# Altium project rockets_test_bench_acquisition.PrjPcb
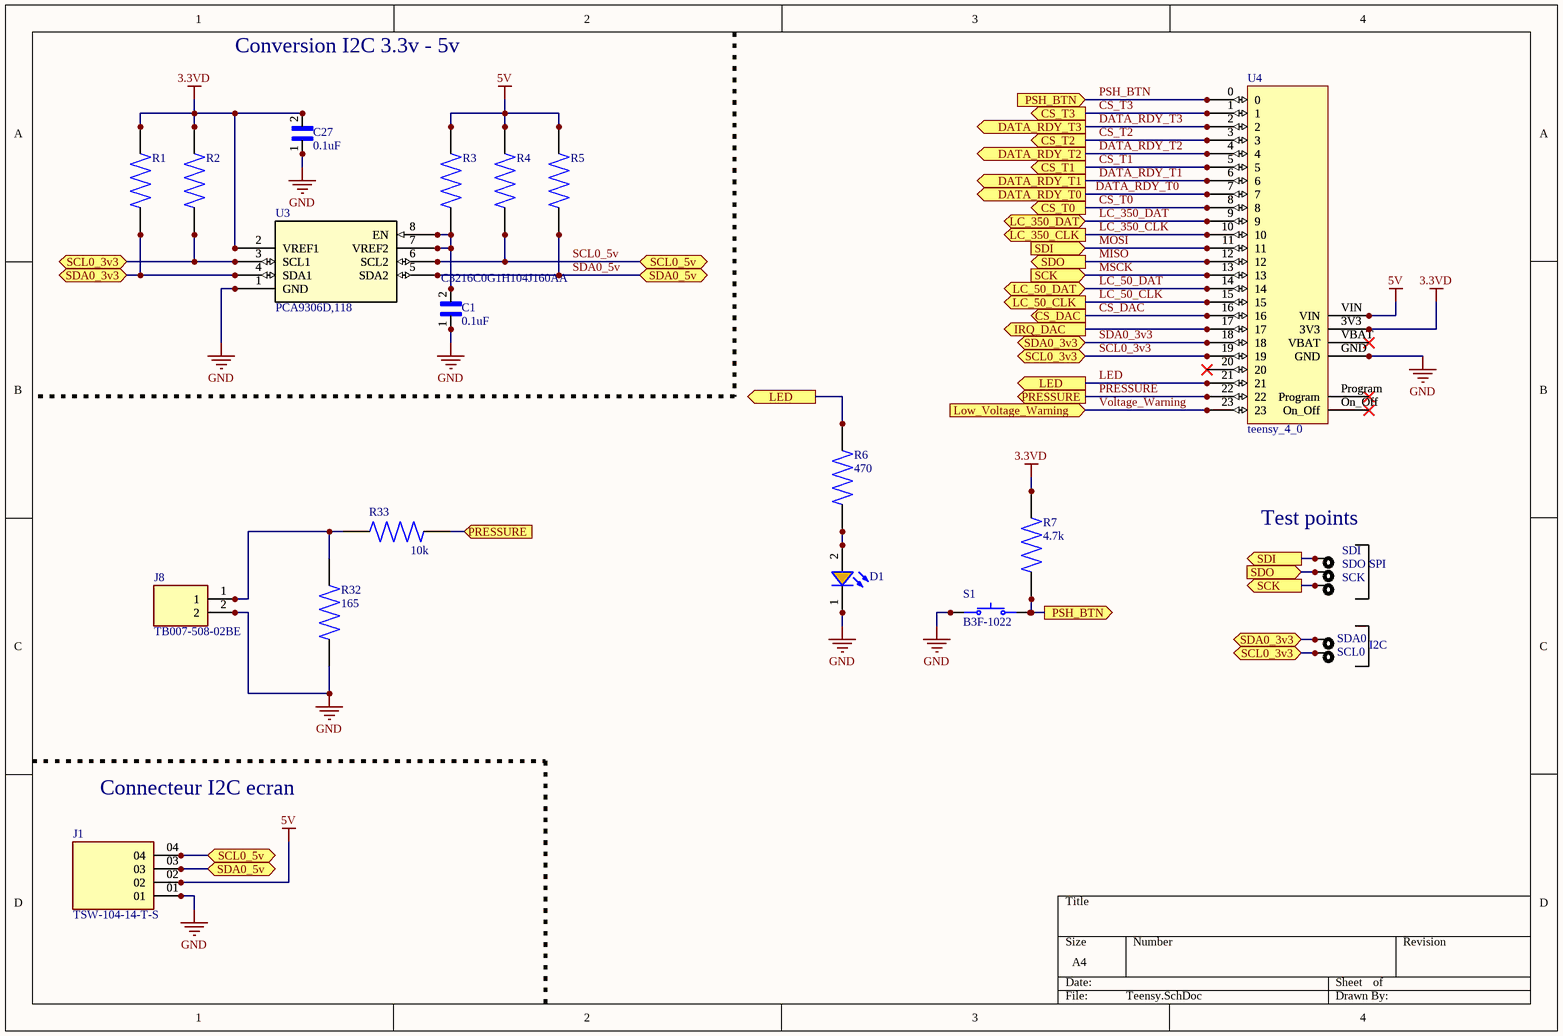
[diagram p0: Teensy.SchDoc]
5 sheets, 106 parts. Net scope: flat (ports and power ports of the same name join across sheets).
Board file: PCB_rockets_test_bench_acquisition.PcbDoc
Sheets:
  Teensy.SchDoc
  Thermocouples.SchDoc
  Loadcells.SchDoc
  DAC.SchDoc
  Alim.SchDoc

## Sheet Teensy.SchDoc
size A4

### Parts
C1  C3216C0G1H104J160AA  value 0.1uF  [C3216C0G1H104J160AA]
C27  value 0.1uF  [C3216C0G1H104J160AA]  (hidden comment: C3216C0G1H104J160AA)
D1  150120YS75000  [150120YS75000]  (value not drawn)
J1  TSW-104-14-T-S  [TSW-104-14-T-S]
J8  TB007-508-02BE  [CUI_TB007-508-02BE]
R1  ESR10EZPJ222  [RESC2012X65N]  (value not drawn)
R2  ESR10EZPJ222  [RESC2012X65N]  (value not drawn)
R3  ERJ-6GEYJ204V  [RESC2012X70N]  (value not drawn)
R4  ESR10EZPJ222  [RESC2012X65N]  (value not drawn)
R5  ESR10EZPJ222  [RESC2012X65N]  (value not drawn)
R6  value 470  [RMCF1206JT470R]  (hidden comment: RMCF1206JT470R)
R7  value 4.7k  [CRGH0805F4K7]  (hidden comment: CRGH0805F4K7)
R32  value 165  [RC1206FR-07165RL]  (hidden comment: RC1206FR-07165RL)
R33  value 10k  [ERJ-P06J103V]  (hidden comment: ERJ-P06J103V)
S1  B3F-1022  [B3F-1022]
SCK  RCS-0C  [RCS-0C]  (value not drawn)
SCL0  RCS-0C  [RCS-0C]  (value not drawn)
SDA0  RCS-0C  [RCS-0C]  (value not drawn)
SDI  RCS-0C  [RCS-0C]  (value not drawn)
SDO  RCS-0C  [RCS-0C]  (value not drawn)
U3  PCA9306D,118  [SO8_SOT96-1_NXP]
U4  teensy_4_0  [teensy_4_0]

### Ports
CS_DAC (out), CS_T0 (out), CS_T1 (out), CS_T2 (out), CS_T3 (out), DATA_RDY_T0 (out), DATA_RDY_T1 (out), DATA_RDY_T2 (out), DATA_RDY_T3 (out), IRQ_DAC (out), LC_50_CLK (out), LC_50_DAT (bidir), LC_350_CLK (out), LC_350_DAT (bidir), LED (out), Low_Voltage_Warning (in), PRESSURE (in), PRESSURE (out), PSH_BTN (in), PSH_BTN (out), SCK (in), SCK (out), SCL0_3v3 (bidir), SCL0_5v (bidir), SDA0_3v3 (bidir), SDA0_5v (bidir), SDI (in), SDI (out), SDO (in), SDO (out)

### Nets
3.3VD: C27.2 R1.2 R2.2 R7.2 U3.2(VREF1) U4.3V3
5V: J1.02 R3.2 R4.2 R5.2 U4.VIN
GND: C1.1 C27.1 D1.1(K) J1.01 J8.2 R32.1 S1.1(COM) U3.1(GND) U4.GND
CS_DAC: U4.16 ; port CS_DAC
CS_T0: U4.8 ; port CS_T0
CS_T1: U4.5 ; port CS_T1
CS_T2: U4.3 ; port CS_T2
CS_T3: U4.1 ; port CS_T3
DATA_RDY_T0: U4.7 ; port DATA_RDY_T0
DATA_RDY_T1: U4.6 ; port DATA_RDY_T1
DATA_RDY_T2: U4.4 ; port DATA_RDY_T2
DATA_RDY_T3: U4.2 ; port DATA_RDY_T3
LC_50_CLK: U4.15 ; port LC_50_CLK
LC_50_DAT: U4.14 ; port LC_50_DAT
LC_350_CLK: U4.10 ; port LC_350_CLK
LC_350_DAT: U4.9 ; port LC_350_DAT
LED: R6.2 U4.21 ; port LED
MISO: SDO.1 U4.12 ; port SDO
MOSI: SDI.1 U4.11 ; port SDI
MSCK: SCK.1 U4.13 ; port SCK
PRESSURE: R33.2 U4.22 ; port PRESSURE
PSH_BTN: R7.1 S1.3(NO) U4.0 ; port PSH_BTN
SCL0_3v3: R2.1 SCL0.1 U3.3(SCL1) U4.19 ; port SCL0_3v3
SCL0_5v: J1.04 R4.1 U3.6(SCL2) ; port SCL0_5v
SDA0_3v3: R1.1 SDA0.1 U3.4(SDA1) U4.18 ; port SDA0_3v3
SDA0_5v: J1.03 R5.1 U3.5(SDA2) ; port SDA0_5v
Voltage_Warning: U4.23 ; port Low_Voltage_Warning
NetC1_2: C1.2 R3.1 U3.7(VREF2) U3.8(EN)
NetD1_2: D1.2(A) R6.1
NetJ8_1: J8.1 R32.2 R33.1
NetR16_1: U4.17 ; port IRQ_DAC

Not connected (* = marked no-connect by the designer): U4 20* On_Off* Program* VBAT*

### Notes on the sheet
- Conversion I2C 3.3v - 5v
- Test points
- SPI
- I2C
- Connecteur I2C ecran

### Library data of the parts
D1 = 150120YS75000: Yellow 590nm LED Indication - Discrete 2V 1206 (3216 Metric)
J8 = TB007-508-02BE: 2~24 Poles, Screw Type, Horizontal, 5.08 Pitch, 24~12 _AWG_, Terminal Block Connector; MF: CUI Devices; SnapEDA_Link: https://www.snapeda.com/parts/TB007-508-02BE/CUI%20Devices/view-part/3591212/?ref=snap; Value: *; Availability: Unavailable; MP: TB007-508-02BE; Price: None; Package: None
R1 R2 R4 R5 = ESR10EZPJ222: 2.2 kOhms Â±5% 0.4W, 2/5W Chip Resistor 0805 (2012 Metric) Automotive AEC-Q200, Pulse Withstanding Thick Film; MF: Rohm; MP: ESR10EZPJ222; Value: *; Purchase-URL: https://pricing.snapeda.com/search/part/ESR10EZPJ222/?ref=eda; Package: 2012 Rohm Semiconductor; Check_prices: https://www.snapeda.com/parts/ESR10EZPJ222/Rohm/view-part/977759/?ref=eda; Digi-Key_Part_Number: RHM2.2KKCT-ND; SnapEDA_Link: https://www.snapeda.com/parts/ESR10EZPJ222/Rohm/view-part/977759/?ref=snap
R3 = ERJ-6GEYJ204V: Resistor;Thick Film;Res 200 Kilohms;Pwr-Rtg 0.125 W;Tol 5%;SMT;0805;Tape & Reel; Package: None; Price: None; Value: *; MP: ERJ-6GEYJ204V; Availability: Unavailable
R6 = RMCF1206JT470R: RES 470 OHM 5% 1/4W 1206
R7 = CRGH0805F4K7: CRGH0805 1% 4K7 0.33W; Tolerance: ±1%
R32 = RC1206FR-07165RL: 165 Ohms ±1% 0.25W, 1/4W Chip Resistor 1206 (3216 Metric) Moisture Resistant Thick Film; Tolerance: ±1%
R33 = ERJ-P06J103V: RES SMD 10K OHM 5% 1/2W 0805; Tolerance: ±5%
S1 = B3F-1022: SWITCH TACTILE SPST-NO 0.05A 24V; pin to pad: 1>1+2 3>3+4
SCK SCL0 SDA0 SDI SDO = RCS-0C: PC TEST POINT NATURAL
U3 = PCA9306D,118: No Description Available; Vendor: NXP; Built_By: EMA_Cory; SourceLibrary: Add_to_database_2021-01-28; Datasheet: https://www.nxp.com/docs/en/data-sheet/PCA9306.pdf; Manufacturer_Part_Number: PCA9306D,118; Copyright: Copyright (C) 2018 Accelerated Designs. All rights reserved; RefDes: RefDes; Type: DEV

## Sheet Thermocouples.SchDoc
size A4
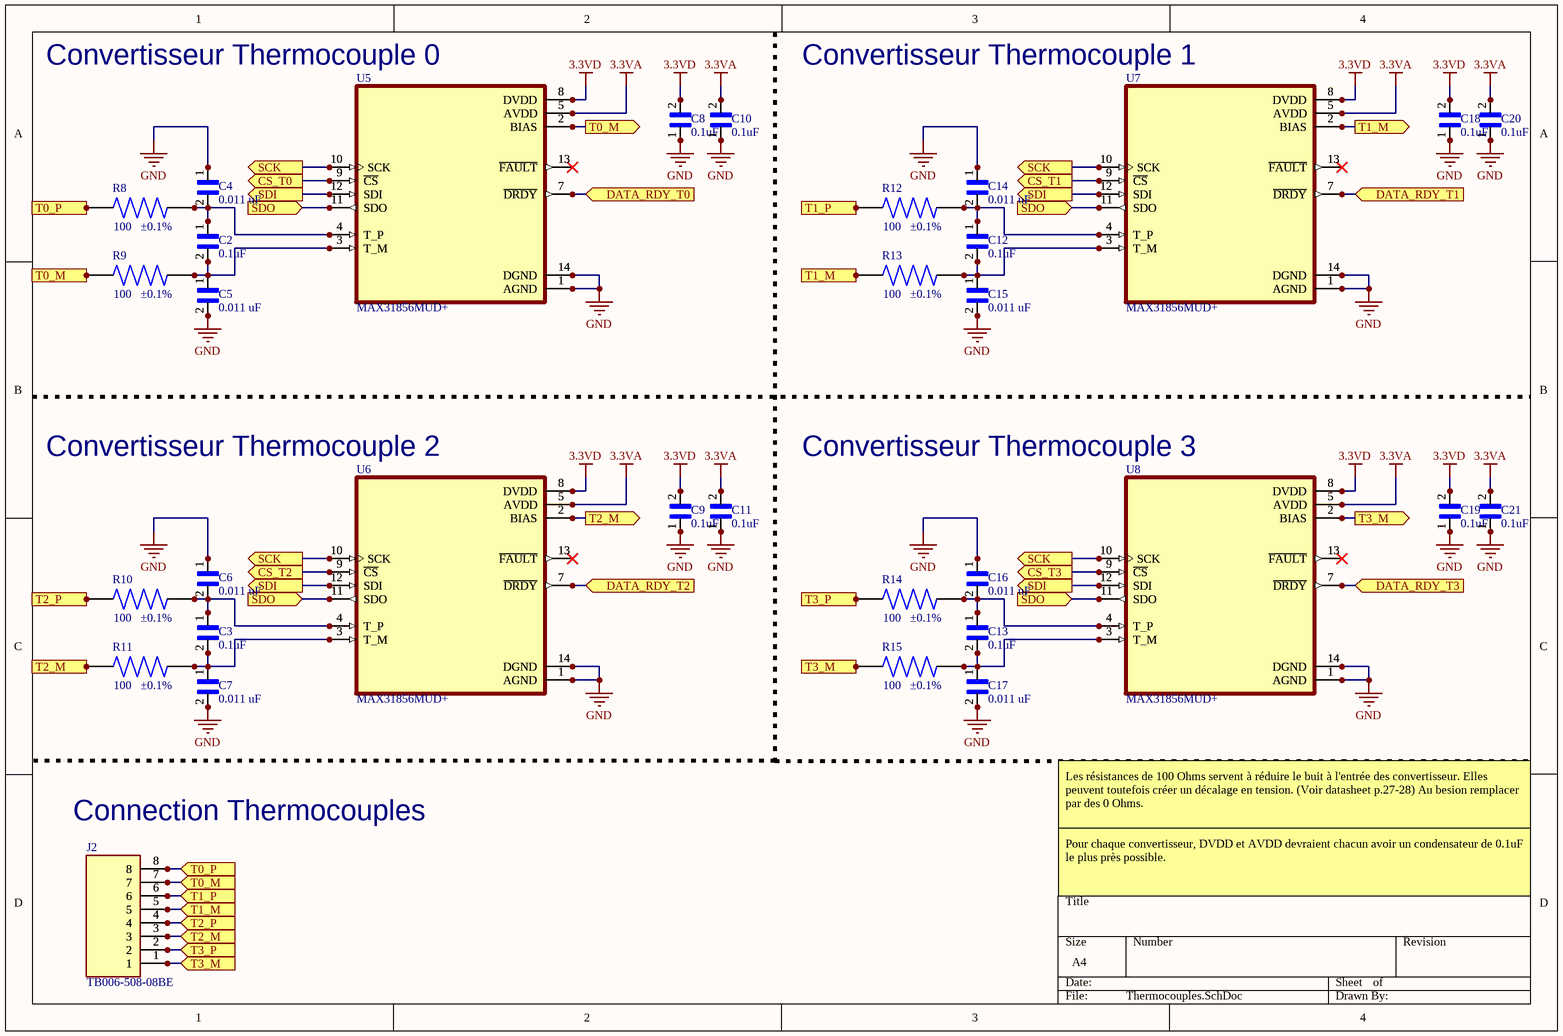
[diagram p1: Thermocouples.SchDoc]

### Parts
C2  value 0.1uF  [C3216C0G1H104J160AA]  (hidden comment: C3216C0G1H104J160AA)
C3  value 0.1uF  [C3216C0G1H104J160AA]  (hidden comment: C3216C0G1H104J160AA)
C4  value 0.011 uF  [GRM3195C1H113JA01D]  (hidden comment: GRM3195C1H113JA01D)
C5  value 0.011 uF  [GRM3195C1H113JA01D]  (hidden comment: GRM3195C1H113JA01D)
C6  value 0.011 uF  [GRM3195C1H113JA01D]  (hidden comment: GRM3195C1H113JA01D)
C7  value 0.011 uF  [GRM3195C1H113JA01D]  (hidden comment: GRM3195C1H113JA01D)
C8  value 0.1uF  [C3216C0G1H104J160AA]  (hidden comment: C3216C0G1H104J160AA)
C9  value 0.1uF  [C3216C0G1H104J160AA]  (hidden comment: C3216C0G1H104J160AA)
C10  value 0.1uF  [C3216C0G1H104J160AA]  (hidden comment: C3216C0G1H104J160AA)
C11  value 0.1uF  [C3216C0G1H104J160AA]  (hidden comment: C3216C0G1H104J160AA)
C12  value 0.1uF  [C3216C0G1H104J160AA]  (hidden comment: C3216C0G1H104J160AA)
C13  value 0.1uF  [C3216C0G1H104J160AA]  (hidden comment: C3216C0G1H104J160AA)
C14  value 0.011 uF  [GRM3195C1H113JA01D]  (hidden comment: GRM3195C1H113JA01D)
C15  value 0.011 uF  [GRM3195C1H113JA01D]  (hidden comment: GRM3195C1H113JA01D)
C16  value 0.011 uF  [GRM3195C1H113JA01D]  (hidden comment: GRM3195C1H113JA01D)
C17  value 0.011 uF  [GRM3195C1H113JA01D]  (hidden comment: GRM3195C1H113JA01D)
C18  value 0.1uF  [C3216C0G1H104J160AA]  (hidden comment: C3216C0G1H104J160AA)
C19  value 0.1uF  [C3216C0G1H104J160AA]  (hidden comment: C3216C0G1H104J160AA)
C20  value 0.1uF  [C3216C0G1H104J160AA]  (hidden comment: C3216C0G1H104J160AA)
C21  value 0.1uF  [C3216C0G1H104J160AA]  (hidden comment: C3216C0G1H104J160AA)
J2  TB006-508-08BE  [TB006-508-08BE]
R8  value 100  Tolerance: ±0.1%  [RNCS1206BKE100R]  (hidden comment: RNCS1206BKE100R)
R9  value 100  Tolerance: ±0.1%  [RNCS1206BKE100R]  (hidden comment: RNCS1206BKE100R)
R10  value 100  Tolerance: ±0.1%  [RNCS1206BKE100R]  (hidden comment: RNCS1206BKE100R)
R11  value 100  Tolerance: ±0.1%  [RNCS1206BKE100R]  (hidden comment: RNCS1206BKE100R)
R12  value 100  Tolerance: ±0.1%  [RNCS1206BKE100R]  (hidden comment: RNCS1206BKE100R)
R13  value 100  Tolerance: ±0.1%  [RNCS1206BKE100R]  (hidden comment: RNCS1206BKE100R)
R14  value 100  Tolerance: ±0.1%  [RNCS1206BKE100R]  (hidden comment: RNCS1206BKE100R)
R15  value 100  Tolerance: ±0.1%  [RNCS1206BKE100R]  (hidden comment: RNCS1206BKE100R)
U5  MAX31856MUD+  [PCBComponent_1]
U6  MAX31856MUD+  [PCBComponent_1]
U7  MAX31856MUD+  [PCBComponent_1]
U8  MAX31856MUD+  [PCBComponent_1]

### Ports
CS_T0 (out), CS_T1 (out), CS_T2 (out), CS_T3 (out), DATA_RDY_T0 (in), DATA_RDY_T1 (in), DATA_RDY_T2 (in), DATA_RDY_T3 (in), SCK (out), SDI (out), SDO (in), T0_M (in), T0_M (out), T0_P (in), T0_P (out), T1_M (in), T1_M (out), T1_P (in), T1_P (out), T2_M (in), T2_M (out), T2_P (in), T2_P (out), T3_M (in), T3_M (out), T3_P (in), T3_P (out)

### Nets
3.3VA: C10.2 C11.2 C20.2 C21.2 U5.5(AVDD) U6.5(AVDD) U7.5(AVDD) U8.5(AVDD)
3.3VD: C8.2 C9.2 C18.2 C19.2 U5.8(DVDD) U6.8(DVDD) U7.8(DVDD) U8.8(DVDD)
GND: C4.1 C5.2 C6.1 C7.2 C8.1 C9.1 C10.1 C11.1 C14.1 C15.2 C16.1 C17.2 C18.1 C19.1 C20.1 C21.1 U5.1(AGND) U5.14(DGND) U6.1(AGND) U6.14(DGND) U7.1(AGND) U7.14(DGND) U8.1(AGND) U8.14(DGND)
CS_T0: U5.9(~{CS}) ; port CS_T0
CS_T1: U7.9(~{CS}) ; port CS_T1
CS_T2: U6.9(~{CS}) ; port CS_T2
CS_T3: U8.9(~{CS}) ; port CS_T3
DATA_RDY_T0: U5.7(~{DRDY}) ; port DATA_RDY_T0
DATA_RDY_T1: U7.7(~{DRDY}) ; port DATA_RDY_T1
DATA_RDY_T2: U6.7(~{DRDY}) ; port DATA_RDY_T2
DATA_RDY_T3: U8.7(~{DRDY}) ; port DATA_RDY_T3
MISO: U5.11(SDO) U6.11(SDO) U7.11(SDO) U8.11(SDO) ; port SDO
MOSI: U5.12(SDI) U6.12(SDI) U7.12(SDI) U8.12(SDI) ; port SDI
MSCK: U5.10(SCK) U6.10(SCK) U7.10(SCK) U8.10(SCK) ; port SCK
NetC2_1: C2.1 C4.2 R8.2 U5.4(T_P)
NetC2_2: C2.2 C5.1 R9.2 U5.3(T_M)
NetC3_1: C3.1 C6.2 R10.2 U6.4(T_P)
NetC3_2: C3.2 C7.1 R11.2 U6.3(T_M)
NetC12_1: C12.1 C14.2 R12.2 U7.4(T_P)
NetC12_2: C12.2 C15.1 R13.2 U7.3(T_M)
NetC13_1: C13.1 C16.2 R14.2 U8.4(T_P)
NetC13_2: C13.2 C17.1 R15.2 U8.3(T_M)
NetJ2_1: J2.1 R15.1 U8.2(BIAS) ; port T3_M
NetJ2_2: J2.2 R14.1 ; port T3_P
NetJ2_3: J2.3 R11.1 U6.2(BIAS) ; port T2_M
NetJ2_4: J2.4 R10.1 ; port T2_P
NetJ2_5: J2.5 R13.1 U7.2(BIAS) ; port T1_M
NetJ2_6: J2.6 R12.1 ; port T1_P
NetJ2_7: J2.7 R9.1 U5.2(BIAS) ; port T0_M
NetJ2_8: J2.8 R8.1 ; port T0_P

Not connected (* = marked no-connect by the designer): U5 13(~{FAULT})*; U6 13(~{FAULT})*; U7 13(~{FAULT})*; U8 13(~{FAULT})*

### Notes on the sheet
- (near U5) Convertisseur Thermocouple 0
- (near U7) Convertisseur Thermocouple 1
- (near U6) Convertisseur Thermocouple 2
- (near U8) Convertisseur Thermocouple 3
- (near J2) Connection Thermocouples
- Les résistances de 100 Ohms servent à réduire le buit à l'entrée des convertisseur. Elles peuvent toutefois créer un décalage en tension. (Voir datasheet p.27-28) Au besion remplacer par des 0 Ohms.
- Pour chaque convertisseur, DVDD et AVDD devraient chacun avoir un condensateur de 0.1uF le plus près possible.

### Library data of the parts
R8-R15 = RNCS1206BKE100R: Res Thin Film 1206 100 Ohm 0.1% 0.125W(1/8W); Supplier 1: Digi-Key; Supplier Part Number 1: RNCS1206BKE100RCT-ND

## Sheet Loadcells.SchDoc
size A4
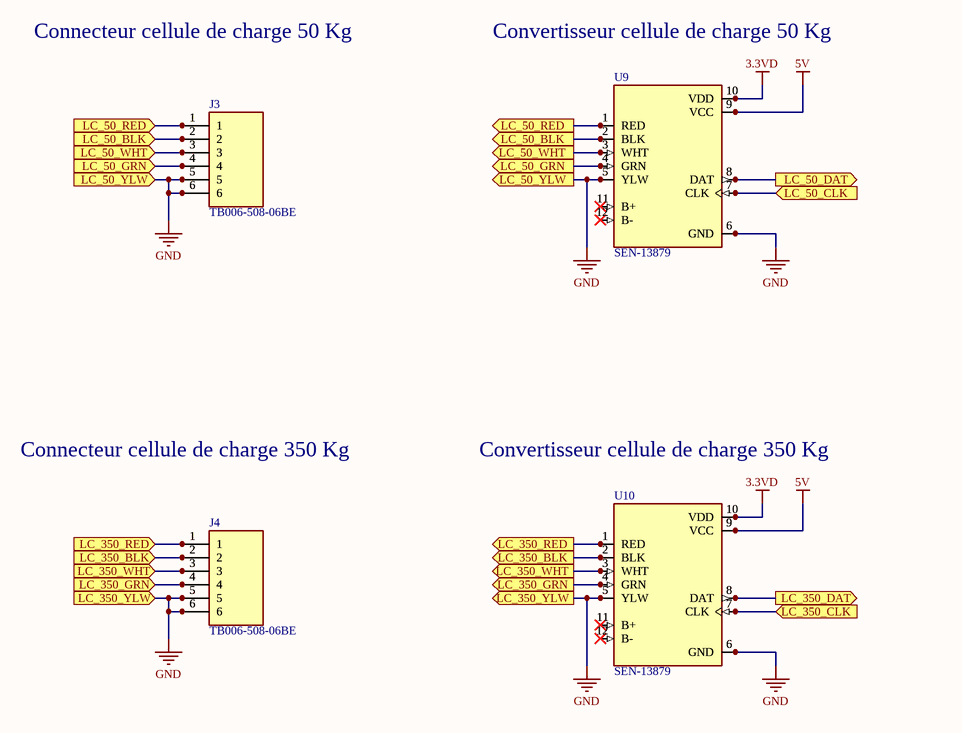
[diagram p2: Loadcells.SchDoc]

### Parts
J3  TB006-508-06BE  [TB006-508-06BE]
J4  TB006-508-06BE  [TB006-508-06BE]
U9  SEN-13879  [SPARKFUN_SEN-13879]
U10  SEN-13879  [SPARKFUN_SEN-13879]

### Ports
LC_50_BLK (in), LC_50_BLK (out), LC_50_CLK (in), LC_50_DAT (out), LC_50_GRN (in), LC_50_GRN (out), LC_50_RED (in), LC_50_RED (out), LC_50_WHT (in), LC_50_WHT (out), LC_50_YLW (in), LC_50_YLW (out), LC_350_BLK (in), LC_350_BLK (out), LC_350_CLK (in), LC_350_DAT (out), LC_350_GRN (in), LC_350_GRN (out), LC_350_RED (in), LC_350_RED (out), LC_350_WHT (in), LC_350_WHT (out), LC_350_YLW (in), LC_350_YLW (out)

### Nets
3.3VD: U9.10(VDD) U10.10(VDD)
5V: U9.9(VCC) U10.9(VCC)
GND: J3.5 J3.6 J4.5 J4.6 U9.5(YLW) U9.6(GND) U10.5(YLW) U10.6(GND) ; port LC_50_YLW, port LC_350_YLW
LC_50_CLK: U9.7(CLK) ; port LC_50_CLK
LC_50_DAT: U9.8(DAT) ; port LC_50_DAT
LC_350_CLK: U10.7(CLK) ; port LC_350_CLK
LC_350_DAT: U10.8(DAT) ; port LC_350_DAT
NetJ3_1: J3.1 U9.1(RED) ; port LC_50_RED
NetJ3_2: J3.2 U9.2(BLK) ; port LC_50_BLK
NetJ3_3: J3.3 U9.3(WHT) ; port LC_50_WHT
NetJ3_4: J3.4 U9.4(GRN) ; port LC_50_GRN
NetJ4_1: J4.1 U10.1(RED) ; port LC_350_RED
NetJ4_2: J4.2 U10.2(BLK) ; port LC_350_BLK
NetJ4_3: J4.3 U10.3(WHT) ; port LC_350_WHT
NetJ4_4: J4.4 U10.4(GRN) ; port LC_350_GRN

Not connected (* = marked no-connect by the designer): U9 11(B+)* 12(B-)*; U10 11(B+)* 12(B-)*

### Notes on the sheet
- Connecteur cellule de charge 50 Kg
- Convertisseur cellule de charge 50 Kg
- Connecteur cellule de charge 350 Kg
- Convertisseur cellule de charge 350 Kg

### Library data of the parts
J3 J4 = TB006-508-06BE: TERMINAL BLOCK, SCREW TYPE, 5.08
U9 U10 = SEN-13879: External Input Sensor Amplifier; MF: SparkFun; MP: SEN-13879; Package: None; Price: None; Availability: Unavailable; Value: *; SnapEDA_Link: https://www.snapeda.com/parts/SEN-13879/SparkFun%20Electronics/view-part/563337/?ref=snap

## Sheet DAC.SchDoc
size A4
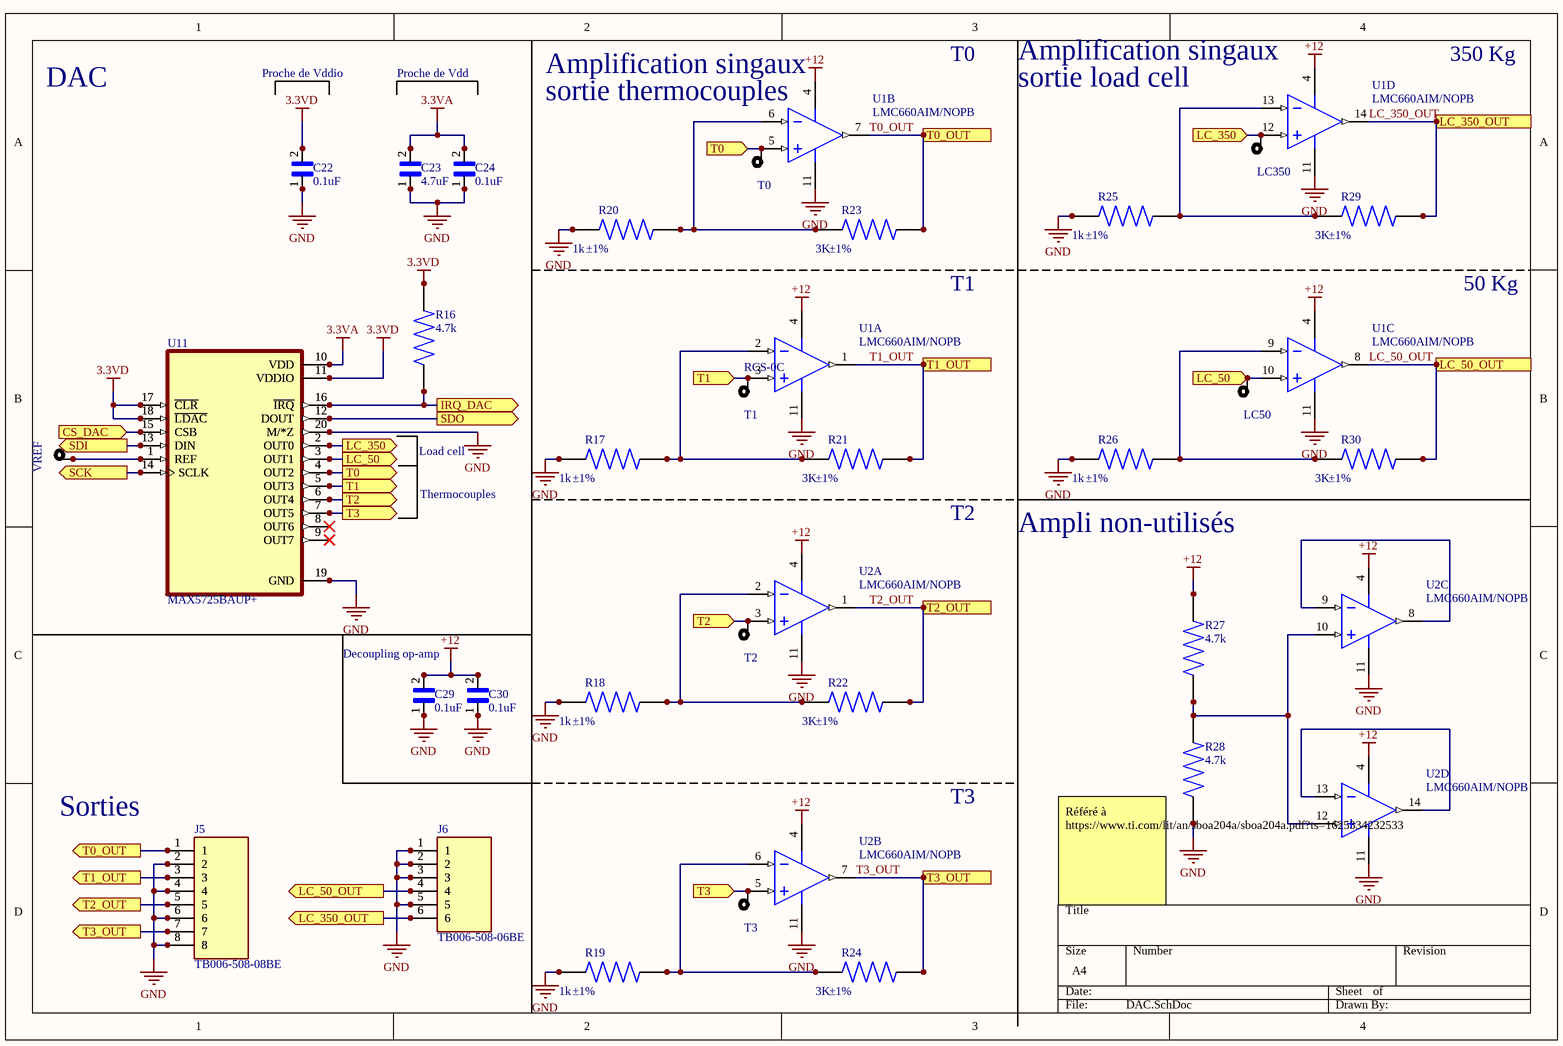
[diagram p3: DAC.SchDoc]

### Parts
C22  value 0.1uF  [C3216C0G1H104J160AA]  (hidden comment: C3216C0G1H104J160AA)
C23  value 4.7uF  [EMK212BB7475MD-T]  (hidden comment: EMK212BB7475MD-T)
C24  value 0.1uF  [C3216C0G1H104J160AA]  (hidden comment: C3216C0G1H104J160AA)
C29  value 0.1uF  [C3216C0G1H104J160AA]  (hidden comment: C3216C0G1H104J160AA)
C30  value 0.1uF  [C3216C0G1H104J160AA]  (hidden comment: C3216C0G1H104J160AA)
J5  TB006-508-08BE  [TB006-508-08BE]
J6  TB006-508-06BE  [TB006-508-06BE]
LC50  RCS-0C  [RCS-0C]  (value not drawn)
LC350  RCS-0C  [RCS-0C]  (value not drawn)
R16  value 4.7k  [CRGH0805F4K7]  (hidden comment: CRGH0805F4K7)
R17  value 1k  Tolerance: ±1%  [CR0805-FX-1001ELF]  (hidden comment: CR0805-FX-1001ELF)
R18  value 1k  Tolerance: ±1%  [CR0805-FX-1001ELF]  (hidden comment: CR0805-FX-1001ELF)
R19  value 1k  Tolerance: ±1%  [CR0805-FX-1001ELF]  (hidden comment: CR0805-FX-1001ELF)
R20  value 1k  Tolerance: ±1%  [CR0805-FX-1001ELF]  (hidden comment: CR0805-FX-1001ELF)
R21  value 3K  Tolerance: ±1%  [CRG0805F3K0]  (hidden comment: CRG0805F3K0)
R22  value 3K  Tolerance: ±1%  [CRG0805F3K0]  (hidden comment: CRG0805F3K0)
R23  value 3K  Tolerance: ±1%  [CRG0805F3K0]  (hidden comment: CRG0805F3K0)
R24  value 3K  Tolerance: ±1%  [CRG0805F3K0]  (hidden comment: CRG0805F3K0)
R25  value 1k  Tolerance: ±1%  [CR0805-FX-1001ELF]  (hidden comment: CR0805-FX-1001ELF)
R26  value 1k  Tolerance: ±1%  [CR0805-FX-1001ELF]  (hidden comment: CR0805-FX-1001ELF)
R27  value 4.7k  [CRGH0805F4K7]  (hidden comment: CRGH0805F4K7)
R28  value 4.7k  [CRGH0805F4K7]  (hidden comment: CRGH0805F4K7)
R29  value 3K  Tolerance: ±1%  [CRG0805F3K0]  (hidden comment: CRG0805F3K0)
R30  value 3K  Tolerance: ±1%  [CRG0805F3K0]  (hidden comment: CRG0805F3K0)
T0  RCS-0C  [RCS-0C]  (value not drawn)
T1  RCS-0C  [RCS-0C]
T2  RCS-0C  [RCS-0C]  (value not drawn)
T3  RCS-0C  [RCS-0C]  (value not drawn)
U1  LMC660AIM/NOPB  [D0014A_N]  (parts A,B,C,D of 4)
U2  LMC660AIM/NOPB  [D0014A_N]  (parts A,B,C,D of 4)
U11  MAX5725BAUP+  [MAX5725BAUP+]
VREF  RCS-0C  [RCS-0C]  (value not drawn)

### Ports
CS_DAC (in), IRQ_DAC (out), LC_50 (in), LC_50 (out), LC_50_OUT (in), LC_50_OUT (out), LC_350 (in), LC_350 (out), LC_350_OUT (in), LC_350_OUT (out), SCK (out), SDI (out), SDO (out), T0 (in), T0 (out), T0_OUT (in), T0_OUT (out), T1 (in), T1 (out), T1_OUT (in), T1_OUT (out), T2 (in), T2 (out), T2_OUT (in), T2_OUT (out), T3 (in), T3 (out), T3_OUT (in), T3_OUT (out)

### Nets
3.3VA: C23.2 C24.2 U11.10(VDD)
3.3VD: C22.2 R16.2 U11.11(VDDIO) U11.17(~{CLR}) U11.18(~{LDAC})
+12: C29.2 C30.2 R27.2 U1.4(V+) U2.4(V+)
GND: C22.1 C23.1 C24.1 C29.1 C30.1 J5.2 J5.4 J5.6 J5.8 J6.1 J6.2 J6.3 J6.5 R17.1 R18.1 R19.1 R20.1 R25.1 R26.1 R28.1 U1.11(V-) U2.11(V-) U11.19(GND) U11.20(M/*Z)
CS_DAC: U11.15(CSB) ; port CS_DAC
LC_50_OUT: J6.4 R30.2 U1.8(OUT3) ; port LC_50_OUT
LC_350_OUT: J6.6 R29.2 U1.14(OUT4) ; port LC_350_OUT
MISO: U11.12(DOUT) ; port SDO
MOSI: U11.13(DIN) ; port SDI
MSCK: U11.14(SCLK) ; port SCK
T0_OUT: J5.1 R23.2 U1.7(OUT2) ; port T0_OUT
T1_OUT: J5.3 R21.2 U1.1(OUT1) ; port T1_OUT
T2_OUT: J5.5 R22.2 U2.1(OUT1) ; port T2_OUT
T3_OUT: J5.7 R24.2 U2.7(OUT2) ; port T3_OUT
NetLC50_1: LC50.1 U1.10(IN3+) U11.3(OUT1) ; port LC_50
NetLC350_1: LC350.1 U1.12(IN4+) U11.2(OUT0) ; port LC_350
NetR16_1: R16.1 U11.16(~{IRQ}) ; port IRQ_DAC
NetR17_2: R17.2 R21.1 U1.2(IN1-)
NetR18_2: R18.2 R22.1 U2.2(IN1-)
NetR19_2: R19.2 R24.1 U2.6(IN2-)
NetR20_2: R20.2 R23.1 U1.6(IN2-)
NetR25_2: R25.2 R29.1 U1.13(IN4-)
NetR26_2: R26.2 R30.1 U1.9(IN3-)
NetR27_1: R27.1 R28.2 U2.10(IN3+) U2.12(IN4+)
NetT0_1: T0.1 U1.5(IN2+) U11.4(OUT2) ; port T0
NetT1_1: T1.1 U1.3(IN1+) U11.5(OUT3) ; port T1
NetT2_1: T2.1 U2.3(IN1+) U11.6(OUT4) ; port T2
NetT3_1: T3.1 U2.5(IN2+) U11.7(OUT5) ; port T3
NetU2_8: U2.8(OUT3) U2.9(IN3-)
NetU2_13: U2.13(IN4-) U2.14(OUT4)
NetU11_1: U11.1(REF) VREF.1

Not connected (* = marked no-connect by the designer): U11 8(OUT6)* 9(OUT7)*

### Notes on the sheet
- DAC
- Proche de Vddio
- Proche de Vdd
- (near U1) Amplification singaux
- (near U1) sortie thermocouples
- T0
- sortie load cell
- 350 Kg
- T1
- 50 Kg
- Load cell
- Thermocouples
- T2
- (near R26) Ampli non-utilisés
- Decoupling op-amp
- (near J5) Sorties
- T3
- (near R28) Référé à https://www.ti.com/lit/an/sboa204a/sboa204a.pdf?ts=1625334232533

### Library data of the parts
C23 = EMK212BB7475MD-T: CAP CER 4.7UF 16V X7R 0805
J6 = TB006-508-06BE: TERMINAL BLOCK, SCREW TYPE, 5.08
LC50 LC350 T0-T3 VREF = RCS-0C: PC TEST POINT NATURAL
R16 R27 R28 = CRGH0805F4K7: CRGH0805 1% 4K7 0.33W; Tolerance: ±1%
R17-R20 R25 R26 = CR0805-FX-1001ELF: 1 kOhms ±1% 0.125W, 1/8W Chip Resistor 0805
R21-R24 R29 R30 = CRG0805F3K0: RES SMD 3K OHM 1% 1/8W 0805
U1 U2 = CMP-0055-00881-3: CMOS Quad Operational Amplifier, 14-pin Narrow SOIC, Pb-Free; Manufacturer: Texas Instruments; PackageTopMarking: NSUZXYTTE#*LMC660AIM; PowerWise: N; CompType: Amplifiers; Package Reference: D0014A; PackageDescription: Molded Package S.O., .150in Wide, 14 Lead; RoHS: Y; Code_IPC: SOIC127P600-14; ComponentLink1URL: http://www.ti.com/general/docs/lit/getliterature.tsp?genericPartNumber=LMC660&fileType=pdf; ComponentLink1Description: Datasheet URL; PinCount: 14; Code_JEDEC: MS-012AB
U11 = MAX5725BAUP: IC DAC 12BIT V-OUT 20TSSOP

## Sheet Alim.SchDoc
size A4
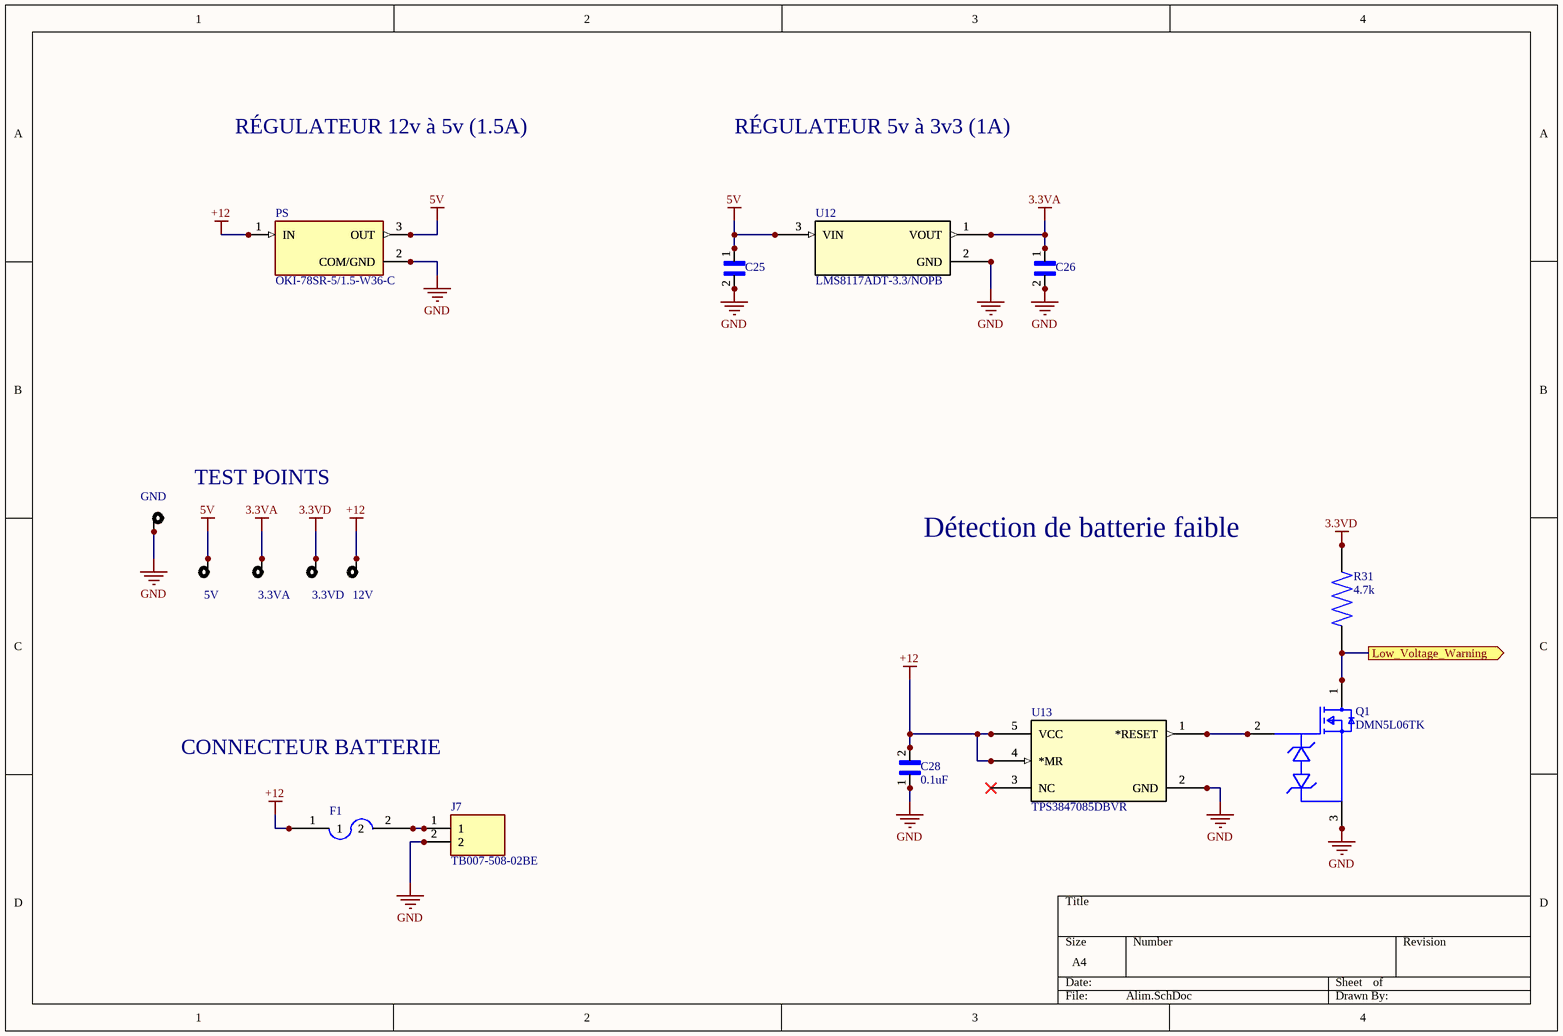
[diagram p4: Alim.SchDoc]

### Parts
3.3VA  RCS-0C  [RCS-0C]  (value not drawn)
3.3VD  RCS-0C  [RCS-0C]  (value not drawn)
5V  RCS-0C  [RCS-0C]  (value not drawn)
12V  RCS-0C  [RCS-0C]  (value not drawn)
C25  TAJP106K010RNJ  [CAPC2012X140N]  (value not drawn)
C26  TAJP106K010RNJ  [CAPC2012X140N]  (value not drawn)
C28  value 0.1uF  [C3216C0G1H104J160AA]  (hidden comment: C3216C0G1H104J160AA)
F1  MF-SM150/33-2  [MF-SM150/33-2]  (value not drawn)
GND  RCS-0C  [RCS-0C]  (value not drawn)
J7  TB007-508-02BE  [CUI_TB007-508-02BE]
PS  OKI-78SR-5/1.5-W36-C  [CONV_OKI-78SR-5/1.5-W36-C]
Q1  DMN5L06TK  [DMN5L06TK]
R31  value 4.7k  [CRGH0805F4K7]  (hidden comment: CRGH0805F4K7)
U12  LMS8117ADT-3.3/NOPB  [TD03B]
U13  TPS3847085DBVR  [DBV5_TEX-M]

### Ports
Low_Voltage_Warning (out)

### Nets
3.3VA: 3.3VA.1 C26.1 U12.1(VOUT)
3.3VD: 3.3VD.1 R31.2
5V: 5V.1 C25.1 PS.3(OUT) U12.3(VIN)
+12: 12V.1 C28.2 F1.1 PS.1(IN) U13.4(*MR) U13.5(VCC)
GND: C25.2 C26.2 C28.1 GND.1 J7.2 PS.2(COM/GND) Q1.3(S) U12.2(GND) U13.2(GND)
Voltage_Warning: Q1.1(D) R31.1 ; port Low_Voltage_Warning
NetF1_2: F1.2 J7.1
NetQ1_2: Q1.2(G) U13.1(*RESET)

Not connected (* = marked no-connect by the designer): U13 3(NC)*

### Notes on the sheet
- RÉGULATEUR 12v à 5v (1.5A)
- RÉGULATEUR 5v à 3v3 (1A)
- (near GND) TEST POINTS
- (near R31) Détection de batterie faible
- CONNECTEUR BATTERIE

### Library data of the parts
3.3VA 3.3VD 5V 12V GND = RCS-0C: PC TEST POINT NATURAL
C25 C26 = TAJP106K010RNJ: TANTALUM CAPACITOR, 10UF, 10V, 0805 10%,; Package: None; Price: None; Value: 10uF; MP: TAJP106K010RNJ; Availability: Unavailable; Parameter 1: *
F1 = MF-SM150/33-2: PTC RESET FUSE 33V 1.5A 2SMD
J7 = TB007-508-02BE: as J8 on sheet Teensy; SnapEDA_Link: https://www.snapeda.com/parts/TB007-508-02BE/CUI%20Devices/view-part/3591212/?ref=snap; Value: *; Availability: Unavailable; MP: TB007-508-02BE; Price: None; Package: None
PS = OKI-78SR-5/1.5-W36-C: Linear Regulator Replacement DC DC Converter 1 Output 5V 1.5A 7V - 36V Input; MF: Murata Power; Availability: Unavailable; Price: None; Package: SIP-3 Murata Power; Value: *; SnapEDA_Link: https://www.snapeda.com/parts/OKI-78SR-5/1.5-W36-C/Murata%20Power%20Solutions%20Inc./view-part/229597/?ref=snap; MP: OKI-78SR-5/1.5-W36-C
R31 = CRGH0805F4K7: CRGH0805 1% 4K7 0.33W; Tolerance: ±1%
U12 = LMS8117ADT-3.3/NOPB: No Description Available; PartNumber: LMS8117ADT-33; Comp: TypeLDO; Vendor: NationalSemiconductor; Symbol: NameLMS8117ADT-33; Library: ReferenceLMS8117ADT; Type: DEV; Version: 1; base_pn: LMS8117A; Pin: Count3; Copyright: Copyright (C) 2021 Accelerated Designs. All rights reserved; RefDes: RefDes
U13 = TPS3847085DBVR: No Description Available; Vendor: Texas Instruments; Built_By: EMA_UL_Team; SourceLibrary: TI_2017-02-16; Manufacturer_Part_Number: TPS3847085DBVR; Copyright: Copyright (C) 2021 Accelerated Designs. All rights reserved; RefDes: RefDes; Type: DEV

## Nets that join several sheets
3.3VA: Thermocouples (8 pins), DAC (C23.2 C24.2 U11.10), Alim (3.3VA.1 C26.1 U12.1)
3.3VD: Teensy (6 pins), Thermocouples (8 pins), Loadcells (U9.10 U10.10), DAC (5 pins), Alim (3.3VD.1 R31.2)
5V: Teensy (5 pins), Loadcells (U9.9 U10.9), Alim (5V.1 C25.1 PS.3 U12.3)
+12: DAC (5 pins), Alim (6 pins)
GND: Teensy (9 pins), Thermocouples (24 pins), Loadcells (8 pins), DAC (24 pins), Alim (9 pins)
CS_DAC: Teensy (U4.16), DAC (U11.15)
CS_T0: Teensy (U4.8), Thermocouples (U5.9)
CS_T1: Teensy (U4.5), Thermocouples (U7.9)
CS_T2: Teensy (U4.3), Thermocouples (U6.9)
CS_T3: Teensy (U4.1), Thermocouples (U8.9)
DATA_RDY_T0: Teensy (U4.7), Thermocouples (U5.7)
DATA_RDY_T1: Teensy (U4.6), Thermocouples (U7.7)
DATA_RDY_T2: Teensy (U4.4), Thermocouples (U6.7)
DATA_RDY_T3: Teensy (U4.2), Thermocouples (U8.7)
LC_50_CLK: Teensy (U4.15), Loadcells (U9.7)
LC_50_DAT: Teensy (U4.14), Loadcells (U9.8)
LC_350_CLK: Teensy (U4.10), Loadcells (U10.7)
LC_350_DAT: Teensy (U4.9), Loadcells (U10.8)
MISO: Teensy (SDO.1 U4.12), Thermocouples (U5.11 U6.11 U7.11 U8.11), DAC (U11.12)
MOSI: Teensy (SDI.1 U4.11), Thermocouples (U5.12 U6.12 U7.12 U8.12), DAC (U11.13)
MSCK: Teensy (SCK.1 U4.13), Thermocouples (U5.10 U6.10 U7.10 U8.10), DAC (U11.14)
NetR16_1: Teensy (U4.17), DAC (R16.1 U11.16)
Voltage_Warning: Teensy (U4.23), Alim (Q1.1 R31.1)